# Altium schematic sheet BBB.SchDoc
size Tabloid
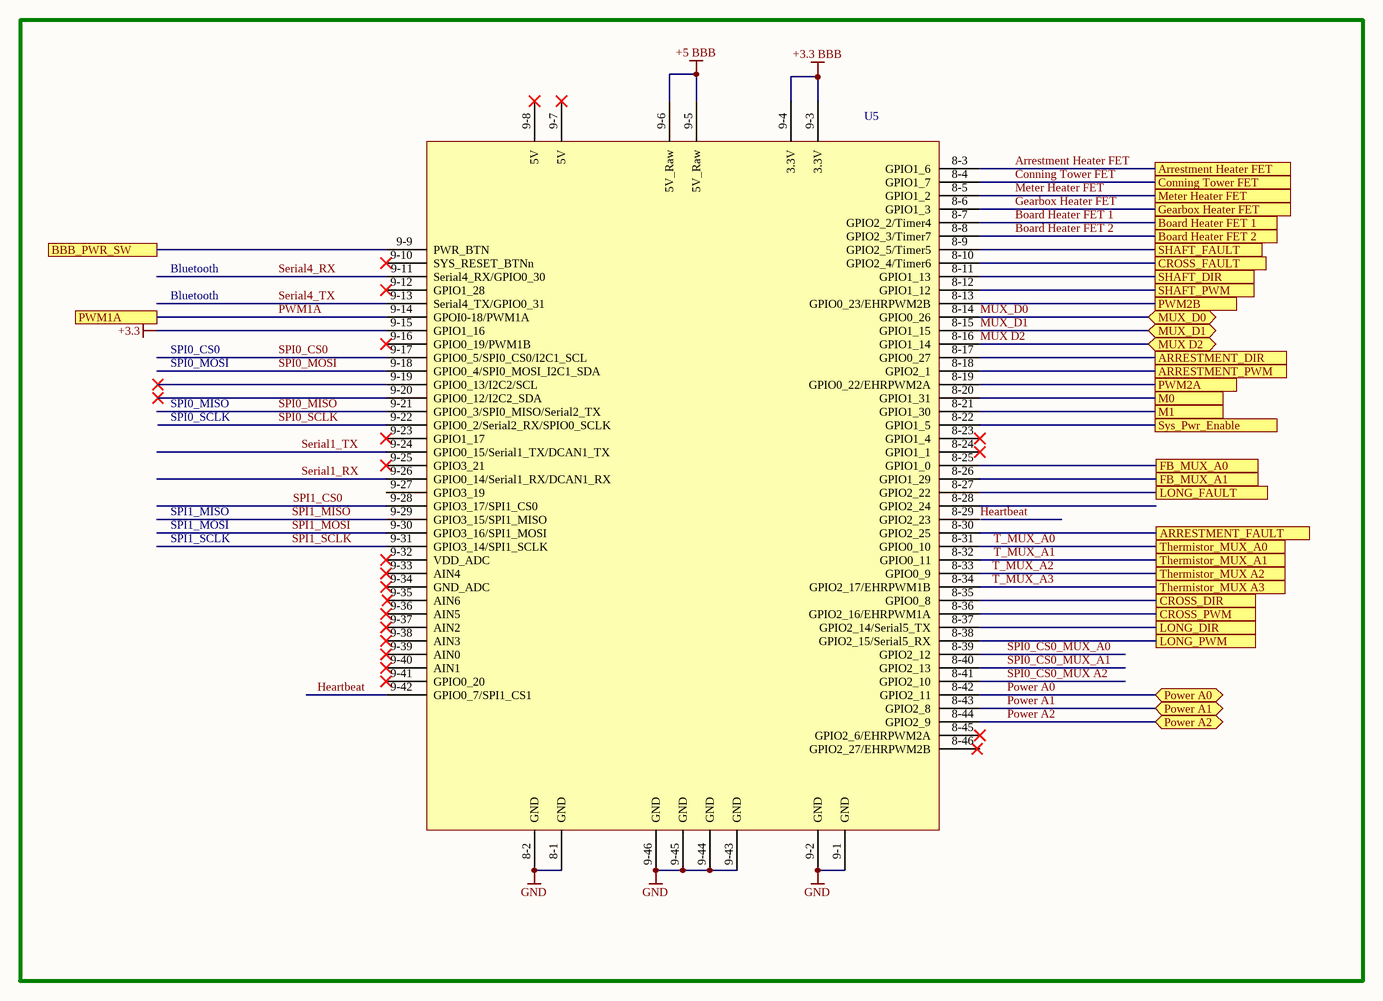
[diagram p0: BBB.SchDoc]

## Parts
U5  BBB Header x 2  [Beaglebone Black Thru]  (value not drawn)

## Ports
Arrestment Heater FET, ARRESTMENT_DIR, ARRESTMENT_FAULT, ARRESTMENT_PWM, BBB_PWR_SW, Board Heater FET 1, Board Heater FET 2, Conning Tower FET, CROSS_DIR, CROSS_FAULT, CROSS_PWM, FB_MUX_A0, FB_MUX_A1, Gearbox Heater FET, LONG_DIR, LONG_FAULT, LONG_PWM, M0, M1, Meter Heater FET, MUX D2, MUX_D0, MUX_D1, Power A0, Power A1, Power A2, PWM1A, PWM2A, PWM2B, SHAFT_DIR, SHAFT_FAULT, SHAFT_PWM, Sys_Pwr_Enable, Thermistor_MUX A2, Thermistor_MUX A3, Thermistor_MUX_A0, Thermistor_MUX_A1

## Nets
+3.3: U5.9-15(GPIO1_16)
+3.3 BBB: U5.9-3(3.3V) U5.9-4(3.3V)
+5 BBB: U5.9-5(5V_Raw) U5.9-6(5V_Raw)
GND: U5.8-1(GND) U5.8-2(GND) U5.9-1(GND) U5.9-2(GND) U5.9-43(GND) U5.9-44(GND) U5.9-45(GND) U5.9-46(GND)
Arrestment Heater FET: U5.8-3(GPIO1_6) ; port Arrestment Heater FET
ARRESTMENT_DIR: U5.8-17(GPIO0_27) ; port ARRESTMENT_DIR
ARRESTMENT_FAULT: U5.8-30(GPIO2_25) ; port ARRESTMENT_FAULT
ARRESTMENT_PWM: U5.8-18(GPIO2_1) ; port ARRESTMENT_PWM
BBB_PWR_SW: U5.9-9(PWR_BTN) ; port BBB_PWR_SW
Board Heater FET 1: U5.8-7(GPIO2_2/Timer4) ; port Board Heater FET 1
Board Heater FET 2: U5.8-8(GPIO2_3/Timer7) ; port Board Heater FET 2
Conning Tower FET: U5.8-4(GPIO1_7) ; port Conning Tower FET
CROSS_DIR: U5.8-35(GPIO0_8) ; port CROSS_DIR
CROSS_FAULT: U5.8-10(GPIO2_4/Timer6) ; port CROSS_FAULT
CROSS_PWM: U5.8-36(GPIO2_16/EHRPWM1A) ; port CROSS_PWM
FB_MUX_A0: U5.8-25(GPIO1_0) ; port FB_MUX_A0
FB_MUX_A1: U5.8-26(GPIO1_29) ; port FB_MUX_A1
Gearbox Heater FET: U5.8-6(GPIO1_3) ; port Gearbox Heater FET
Heartbeat: U5.8-29(GPIO2_23) U5.9-42(GPIO0_7/SPI1_CS1)
LONG_DIR: U5.8-37(GPIO2_14/Serial5_TX) ; port LONG_DIR
LONG_FAULT: U5.8-27(GPIO2_22) ; port LONG_FAULT
LONG_PWM: U5.8-38(GPIO2_15/Serial5_RX) ; port LONG_PWM
M0: U5.8-20(GPIO1_31) ; port M0
M1: U5.8-21(GPIO1_30) ; port M1
Meter Heater FET: U5.8-5(GPIO1_2) ; port Meter Heater FET
MUX D2: U5.8-16(GPIO1_14) ; port MUX D2
MUX_D0: U5.8-14(GPIO0_26) ; port MUX_D0
MUX_D1: U5.8-15(GPIO1_15) ; port MUX_D1
Power A0: U5.8-42(GPIO2_11) ; port Power A0
Power A1: U5.8-43(GPIO2_8) ; port Power A1
Power A2: U5.8-44(GPIO2_9) ; port Power A2
PWM1A: U5.9-14(GPOI0-18/PWM1A) ; port PWM1A
PWM2A: U5.8-19(GPIO0_22/EHRPWM2A) ; port PWM2A
PWM2B: U5.8-13(GPIO0_23/EHRPWM2B) ; port PWM2B
Serial1_RX: U5.9-26(GPIO0_14/Serial1_RX/DCAN1_RX)
Serial1_TX: U5.9-24(GPIO0_15/Serial1_TX/DCAN1_TX)
Serial4_RX: U5.9-11(Serial4_RX/GPIO0_30)
Serial4_TX: U5.9-13(Serial4_TX/GPIO0_31)
SHAFT_DIR: U5.8-11(GPIO1_13) ; port SHAFT_DIR
SHAFT_FAULT: U5.8-9(GPIO2_5/Timer5) ; port SHAFT_FAULT
SHAFT_PWM: U5.8-12(GPIO1_12) ; port SHAFT_PWM
SPI0_CS0: U5.9-17(GPIO0_5/SPI0_CS0/I2C1_SCL)
SPI0_CS0_MUX A2: U5.8-41(GPIO2_10)
SPI0_CS0_MUX_A0: U5.8-39(GPIO2_12)
SPI0_CS0_MUX_A1: U5.8-40(GPIO2_13)
SPI0_MISO: U5.9-21(GPIO0_3/SPI0_MISO/Serial2_TX)
SPI0_MOSI: U5.9-18(GPIO0_4/SPI0_MOSI_I2C1_SDA)
SPI0_SCLK: U5.9-22(GPIO0_2/Serial2_RX/SPIO0_SCLK)
SPI1_CS0: U5.9-28(GPIO3_17/SPI1_CS0)
SPI1_MISO: U5.9-29(GPIO3_15/SPI1_MISO)
SPI1_MOSI: U5.9-30(GPIO3_16/SPI1_MOSI)
SPI1_SCLK: U5.9-31(GPIO3_14/SPI1_SCLK)
Sys_Pwr_Enable: U5.8-22(GPIO1_5) ; port Sys_Pwr_Enable
T_MUX_A0: U5.8-31(GPIO0_10) ; port Thermistor_MUX_A0
T_MUX_A1: U5.8-32(GPIO0_11) ; port Thermistor_MUX_A1
T_MUX_A2: U5.8-33(GPIO0_9) ; port Thermistor_MUX A2
T_MUX_A3: U5.8-34(GPIO2_17/EHRPWM1B) ; port Thermistor_MUX A3

Not connected (* = marked no-connect by the designer): U5 8-23(GPIO1_4)* 8-24(GPIO1_1)* 8-28(GPIO2_24) 8-45(GPIO2_6/EHRPWM2A)* 8-46(GPIO2_27/EHRPWM2B) 9-7(5V)* 9-8(5V)* 9-10(SYS_RESET_BTNn)* 9-12(GPIO1_28)* 9-16(GPIO0_19/PWM1B)* 9-19(GPIO0_13/I2C2/SCL)* 9-20(GPIO0_12/I2C2_SDA)* 9-23(GPIO1_17)* 9-25(GPIO3_21)* 9-27(GPIO3_19) 9-32(VDD_ADC)* 9-33(AIN4)* 9-34(GND_ADC)* 9-35(AIN6) 9-36(AIN5)* 9-37(AIN2)* 9-38(AIN3)* 9-39(AIN0)* 9-40(AIN1)* 9-41(GPIO0_20)*

## Notes on the sheet
- Bluetooth
- SPI0_CS0
- SPI0_MOSI
- SPI0_MISO
- SPI0_SCLK
- SPI1_MISO
- SPI1_MOSI
- SPI1_SCLK
- Title
- Size:
- Date:
- Tabloid
- Number:
- Time:
- Revision:
- Sheet
- of
- ZLS Corporation
- 7801 North Lamar Blvd.
- Suite E-184
- Austin, Texas 78752  USA
- (512) 453-0288
- File:

## Library data of the parts
U5 = Beaglebone_Black: Beaglebone Black Header; Manufacturer: Samtec Inc.; Manufacturer Part Number: SSW-123-03-G-D; Connector Type: Receptacle; Style: Board to Board or Cable; Number of Positions: 46; Number of Positions Loaded: All; Pitch - Mating: 0.100" (2.54mm); Contact Length - Post: 0.394" (10.00mm); Material Flammability Rating: UL94 V-0; Current Rating: 5.7A per Contact; Supplier 1: Digi-Key; Supplier Part Number 1: SSW-123-03-G-D-ND; RoHS: RoHS Compliant; Category: Connectors, Interconnects; Stock 1: 0; Pricing 1: 1=6.51 (USD); Packaging: Bulk; Part Status: Active; Contact Type: Forked; Row Spacing - Mating: 0.100" (2.54mm); Mounting Type: Through Hole; Termination: Solder; Fastening Type: Push-Pull; Contact Finish - Mating: Gold; Contact Finish Thickness - Mating: 20.0µin (0.51µm); Insulation Color: Black; Insulation Height: 0.335" (8.51mm); Operating Temperature: -55°C ~ 125°C; Contact Finish - Post: Gold; Mated Stacking Heights: -; Ingress Protection: -; Features: -; Voltage Rating: -; Applications: -; Insulation Material: Liquid Crystal Polymer (LCP); Contact Shape: Square; Contact Material: Phosphor Bronze; Contact Finish Thickness - Post: 3.00µin (0.076µm)